# Altium schematic sheet Teslamodell_1.SchDoc
size A4
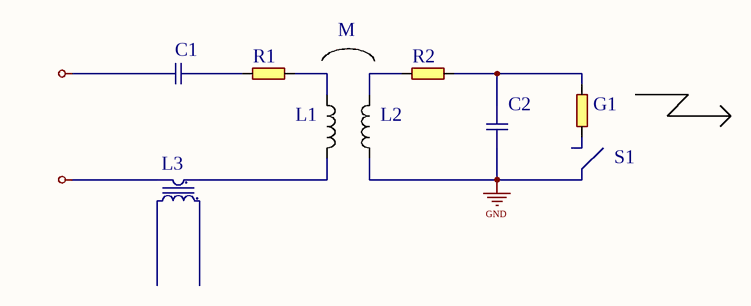
[diagram p0: Teslamodell_1.SchDoc]

## Parts
C1  PC/HV/S/WF 22NF  [CAPAD340W1L280D11B]  (value not drawn)
C2  PC/HV/S/WF 22NF  [CAPAD340W1L280D11B]  (value not drawn)
G1  10  [RESA_0.25W]  (value not drawn)
L1  SMD spoler  [INDP3225X20N]  (value not drawn)
L2  SMD spoler  [INDP3225X20N]  (value not drawn)
L3  CurrentSenseTransformer  (value not drawn)
R1  10  [RESA_0.25W]  (value not drawn)
R2  10  [RESA_0.25W]  (value not drawn)

## Nets
GND: C2.1 L2.1
VCC: C1.1 L3.1
NetC1_2: C1.2 R1.1
NetC2_2: C2.2 G1.2 R2.1
NetL1_1: L1.1 R1.2
NetL1_2: L1.2 L3.2
NetL2_2: L2.2 R2.2

Not connected (* = marked no-connect by the designer): G1 1; L3 3 4

## Notes on the sheet
- M
- (near G1) S1
- Size:
- Date:
- Title:
- A3
- Revision:
- Sheet
- of
- Author:
- File:

## Library data of the parts
C1 C2 = 3176: CAP, FILM, PP, 22NF, 1.5KV, AXIAL; id: 3176; pakke_opprettet_av: 815; leverandor_varenr: 9520384; pris: 10; nokkelord: Capacitor, Kondensator; produsent: LCR Components; leverandor: Farnell; pakketype: TH; pakke_opprettet: 07.06.2015 15:46:51; symbol_opprettet_av: 815; symbol_opprettet: 14.11.2014 20:19:34; navn: PC/HV/S/WF 22NF
G1 R1 R2 = 2759: 0.25W 1% Generic resistor; id: 2759; rad: 1; rom: OV; lager_type: Fremlager; dybde: 0; hylle: 8; antall: 100; pakke_opprettet_av: 815; symbol_opprettet_av: oystesm; nokkelord: Motstand, Resistor; pakketype: 92; kolonne: 0; pakke_opprettet: 28.06.2014 17:13:33; symbol_opprettet: 08.07.2014 21:16:33; navn: 10; pris: 0
L1 L2 = 1739: SMD inductors og tomme SMD bokser; id: 1739; pakke_opprettet_av: 924; pris: -1; pakke_opprettet: 26.05.2015 23:51:10; symbol_opprettet_av: 924; symbol_opprettet: 27.05.2015 00:20:21; navn: SMD spoler; pakketype: SMD
L3 = 3771: id: 3771; symbol_opprettet_av: 815; pris: 100; produsent: OV; symbol_opprettet: 29.09.2016 16:19:11; navn: CurrentSenseTransformer; pakketype: -